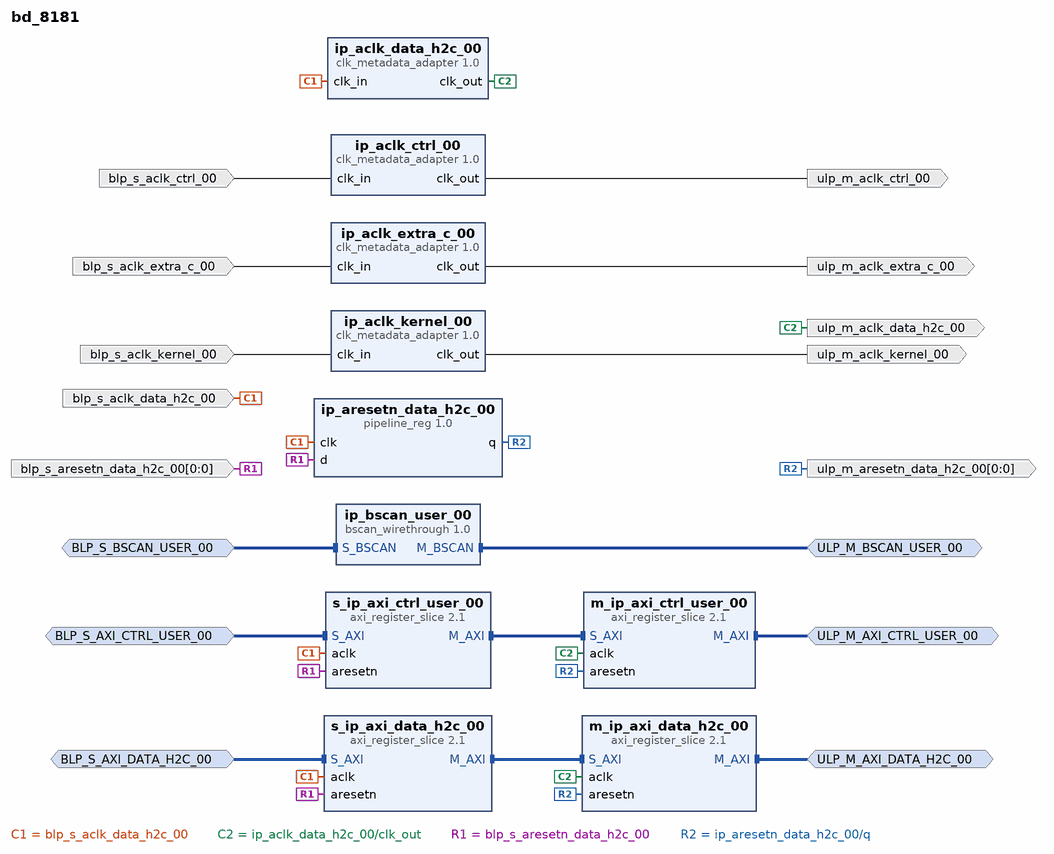
[diagram p0: block diagram of the top level]
# Vivado block design bd_8181, xcvu9p-flgb2104-2-i, Vivado 2019.2
create_bd_design bd_8181

create_bd_intf_port -mode Slave -vlnv xilinx.com:interface:aximm_rtl:1.0 BLP_S_AXI_CTRL_USER_00
set_property -dict [list \
  CONFIG.DATA_WIDTH 32 \
  CONFIG.FREQ_HZ 250000000 \
  CONFIG.ADDR_WIDTH 25 \
  CONFIG.AWUSER_WIDTH 0 \
  CONFIG.ARUSER_WIDTH 0 \
  CONFIG.WUSER_WIDTH 0 \
  CONFIG.RUSER_WIDTH 0 \
  CONFIG.BUSER_WIDTH 0 \
  CONFIG.READ_WRITE_MODE READ_WRITE \
  CONFIG.NUM_READ_OUTSTANDING 2 \
  CONFIG.NUM_WRITE_OUTSTANDING 2 \
  CONFIG.PHASE 0 \
  CONFIG.CLK_DOMAIN cd_data_h2c_00 \
  CONFIG.SLR_ASSIGNMENT slr0 \
] [get_bd_intf_ports BLP_S_AXI_CTRL_USER_00]
create_bd_intf_port -mode Master -vlnv xilinx.com:interface:aximm_rtl:1.0 ULP_M_AXI_CTRL_USER_00
set_property -dict [list \
  CONFIG.DATA_WIDTH 32 \
  CONFIG.FREQ_HZ 250000000 \
  CONFIG.ADDR_WIDTH 25 \
  CONFIG.AWUSER_WIDTH 0 \
  CONFIG.ARUSER_WIDTH 0 \
  CONFIG.WUSER_WIDTH 0 \
  CONFIG.RUSER_WIDTH 0 \
  CONFIG.BUSER_WIDTH 0 \
  CONFIG.READ_WRITE_MODE READ_WRITE \
  CONFIG.NUM_READ_OUTSTANDING 2 \
  CONFIG.NUM_WRITE_OUTSTANDING 2 \
  CONFIG.PHASE 0 \
  CONFIG.CLK_DOMAIN cd_data_h2c_00 \
  CONFIG.SLR_ASSIGNMENT slr0 \
] [get_bd_intf_ports ULP_M_AXI_CTRL_USER_00]
create_bd_intf_port -mode Slave -vlnv xilinx.com:interface:aximm_rtl:1.0 BLP_S_AXI_DATA_H2C_00
set_property -dict [list \
  CONFIG.PROTOCOL AXI4 \
  CONFIG.FREQ_HZ 250000000 \
  CONFIG.ADDR_WIDTH 64 \
  CONFIG.AWUSER_WIDTH 0 \
  CONFIG.ARUSER_WIDTH 0 \
  CONFIG.WUSER_WIDTH 0 \
  CONFIG.RUSER_WIDTH 0 \
  CONFIG.BUSER_WIDTH 0 \
  CONFIG.READ_WRITE_MODE READ_WRITE \
  CONFIG.HAS_BURST 1 \
  CONFIG.HAS_WSTRB 1 \
  CONFIG.HAS_BRESP 1 \
  CONFIG.HAS_RRESP 1 \
  CONFIG.SUPPORTS_NARROW_BURST 0 \
  CONFIG.NUM_READ_OUTSTANDING 16 \
  CONFIG.NUM_WRITE_OUTSTANDING 16 \
  CONFIG.MAX_BURST_LENGTH 256 \
  CONFIG.PHASE 0 \
  CONFIG.CLK_DOMAIN cd_data_h2c_00 \
  CONFIG.NUM_READ_THREADS 2 \
  CONFIG.NUM_WRITE_THREADS 2 \
  CONFIG.RUSER_BITS_PER_BYTE 0 \
  CONFIG.WUSER_BITS_PER_BYTE 0 \
  CONFIG.SLR_ASSIGNMENT slr0 \
] [get_bd_intf_ports BLP_S_AXI_DATA_H2C_00]
create_bd_intf_port -mode Master -vlnv xilinx.com:interface:aximm_rtl:1.0 ULP_M_AXI_DATA_H2C_00
set_property -dict [list \
  CONFIG.PROTOCOL AXI4 \
  CONFIG.FREQ_HZ 250000000 \
  CONFIG.ADDR_WIDTH 64 \
  CONFIG.AWUSER_WIDTH 0 \
  CONFIG.ARUSER_WIDTH 0 \
  CONFIG.WUSER_WIDTH 0 \
  CONFIG.RUSER_WIDTH 0 \
  CONFIG.BUSER_WIDTH 0 \
  CONFIG.READ_WRITE_MODE READ_WRITE \
  CONFIG.HAS_BURST 1 \
  CONFIG.HAS_WSTRB 1 \
  CONFIG.HAS_BRESP 1 \
  CONFIG.HAS_RRESP 1 \
  CONFIG.SUPPORTS_NARROW_BURST 0 \
  CONFIG.NUM_READ_OUTSTANDING 16 \
  CONFIG.NUM_WRITE_OUTSTANDING 16 \
  CONFIG.MAX_BURST_LENGTH 256 \
  CONFIG.PHASE 0 \
  CONFIG.CLK_DOMAIN cd_data_h2c_00 \
  CONFIG.NUM_READ_THREADS 2 \
  CONFIG.NUM_WRITE_THREADS 2 \
  CONFIG.RUSER_BITS_PER_BYTE 0 \
  CONFIG.WUSER_BITS_PER_BYTE 0 \
  CONFIG.SLR_ASSIGNMENT slr0 \
] [get_bd_intf_ports ULP_M_AXI_DATA_H2C_00]
create_bd_intf_port -mode Slave -vlnv xilinx.com:interface:bscan_rtl:1.0 BLP_S_BSCAN_USER_00
create_bd_intf_port -mode Master -vlnv xilinx.com:interface:bscan_rtl:1.0 ULP_M_BSCAN_USER_00
create_bd_port -dir I -type clk blp_s_aclk_ctrl_00
set_property -dict {CONFIG.CLK_DOMAIN cd_ctrl_00 CONFIG.FREQ_HZ 125000000 CONFIG.PHASE 0} [get_bd_ports blp_s_aclk_ctrl_00]
create_bd_port -dir O -type clk ulp_m_aclk_ctrl_00
set_property -dict {CONFIG.CLK_DOMAIN cd_ctrl_00 CONFIG.FREQ_HZ 125000000 CONFIG.PHASE 0} [get_bd_ports ulp_m_aclk_ctrl_00]
create_bd_port -dir I -type clk blp_s_aclk_extra_c_00
set_property -dict {CONFIG.CLK_DOMAIN cd_extra_c_00 CONFIG.FREQ_HZ 500000000 CONFIG.PHASE 0} [get_bd_ports blp_s_aclk_extra_c_00]
create_bd_port -dir O -type clk ulp_m_aclk_extra_c_00
set_property -dict {CONFIG.CLK_DOMAIN cd_extra_c_00 CONFIG.FREQ_HZ 500000000 CONFIG.PHASE 0} [get_bd_ports ulp_m_aclk_extra_c_00]
create_bd_port -dir I -type clk blp_s_aclk_data_h2c_00
set_property -dict [list \
  CONFIG.ASSOCIATED_RESET BLP_S_ARESETN_DATA_H2C_00 \
  CONFIG.CLK_DOMAIN cd_data_h2c_00 \
  CONFIG.FREQ_HZ 250000000 \
  CONFIG.PHASE 0 \
] [get_bd_ports blp_s_aclk_data_h2c_00]
create_bd_port -dir O -type clk ulp_m_aclk_data_h2c_00
set_property -dict [list \
  CONFIG.ASSOCIATED_RESET ULP_M_ARESETN_DATA_H2C_00 \
  CONFIG.CLK_DOMAIN cd_data_h2c_00 \
  CONFIG.FREQ_HZ 250000000 \
  CONFIG.PHASE 0 \
] [get_bd_ports ulp_m_aclk_data_h2c_00]
create_bd_port -dir I -type clk blp_s_aclk_kernel_00
set_property -dict {CONFIG.CLK_DOMAIN cd_extra_b_00 CONFIG.FREQ_HZ 250000000 CONFIG.PHASE 0} [get_bd_ports blp_s_aclk_kernel_00]
create_bd_port -dir O -type clk ulp_m_aclk_kernel_00
set_property -dict {CONFIG.CLK_DOMAIN cd_extra_b_00 CONFIG.FREQ_HZ 250000000 CONFIG.PHASE 0} [get_bd_ports ulp_m_aclk_kernel_00]
create_bd_port -dir I -from 0 -to 0 -type rst blp_s_aresetn_data_h2c_00
set_property -dict {CONFIG.POLARITY ACTIVE_LOW} [get_bd_ports blp_s_aresetn_data_h2c_00]
create_bd_port -dir O -from 0 -to 0 -type rst ulp_m_aresetn_data_h2c_00
set_property -dict {CONFIG.POLARITY ACTIVE_LOW} [get_bd_ports ulp_m_aresetn_data_h2c_00]

create_bd_cell -type ip -vlnv xilinx.com:ip:clk_metadata_adapter:1.0 ip_aclk_ctrl_00
create_bd_cell -type ip -vlnv xilinx.com:ip:clk_metadata_adapter:1.0 ip_aclk_extra_c_00
create_bd_cell -type ip -vlnv xilinx.com:ip:clk_metadata_adapter:1.0 ip_aclk_data_h2c_00
create_bd_cell -type ip -vlnv xilinx.com:ip:clk_metadata_adapter:1.0 ip_aclk_kernel_00
create_bd_cell -type ip -vlnv xilinx.com:ip:pipeline_reg:1.0 ip_aresetn_data_h2c_00
set_property -dict {CONFIG.DEPTH 0} [get_bd_cells ip_aresetn_data_h2c_00]
create_bd_cell -type ip -vlnv xilinx.com:ip:axi_register_slice:2.1 s_ip_axi_ctrl_user_00
set_property -dict [list \
  CONFIG.ADDR_WIDTH 25 \
  CONFIG.DATA_WIDTH 32 \
  CONFIG.NUM_READ_OUTSTANDING 2 \
  CONFIG.NUM_WRITE_OUTSTANDING 2 \
  CONFIG.PROTOCOL AXI4LITE \
  CONFIG.READ_WRITE_MODE READ_WRITE \
  CONFIG.REG_AR 0 \
  CONFIG.REG_AW 0 \
  CONFIG.REG_B 0 \
  CONFIG.REG_R 0 \
  CONFIG.REG_W 0 \
] [get_bd_cells s_ip_axi_ctrl_user_00]
create_bd_cell -type ip -vlnv xilinx.com:ip:axi_register_slice:2.1 m_ip_axi_ctrl_user_00
set_property -dict [list \
  CONFIG.ADDR_WIDTH 25 \
  CONFIG.DATA_WIDTH 32 \
  CONFIG.NUM_READ_OUTSTANDING 2 \
  CONFIG.NUM_WRITE_OUTSTANDING 2 \
  CONFIG.PROTOCOL AXI4LITE \
  CONFIG.READ_WRITE_MODE READ_WRITE \
  CONFIG.REG_AR 0 \
  CONFIG.REG_AW 0 \
  CONFIG.REG_B 0 \
  CONFIG.REG_R 0 \
  CONFIG.REG_W 0 \
] [get_bd_cells m_ip_axi_ctrl_user_00]
create_bd_cell -type ip -vlnv xilinx.com:ip:axi_register_slice:2.1 s_ip_axi_data_h2c_00
set_property -dict [list \
  CONFIG.ADDR_WIDTH 64 \
  CONFIG.ARUSER_WIDTH 0 \
  CONFIG.AWUSER_WIDTH 0 \
  CONFIG.BUSER_WIDTH 0 \
  CONFIG.DATA_WIDTH 512 \
  CONFIG.HAS_BRESP 1 \
  CONFIG.HAS_BURST 1 \
  CONFIG.HAS_CACHE 0 \
  CONFIG.HAS_LOCK 0 \
  CONFIG.HAS_PROT 0 \
  CONFIG.HAS_QOS 0 \
  CONFIG.HAS_REGION 0 \
  CONFIG.HAS_RRESP 1 \
  CONFIG.HAS_WSTRB 1 \
  CONFIG.ID_WIDTH 6 \
  CONFIG.MAX_BURST_LENGTH 256 \
  CONFIG.NUM_READ_OUTSTANDING 16 \
  CONFIG.NUM_READ_THREADS 2 \
  CONFIG.NUM_WRITE_OUTSTANDING 16 \
  CONFIG.NUM_WRITE_THREADS 2 \
  CONFIG.PROTOCOL AXI4 \
  CONFIG.READ_WRITE_MODE READ_WRITE \
  CONFIG.REG_AR 0 \
  CONFIG.REG_AW 0 \
  CONFIG.REG_B 0 \
  CONFIG.REG_R 0 \
  CONFIG.REG_W 0 \
  CONFIG.RUSER_BITS_PER_BYTE 0 \
  CONFIG.RUSER_WIDTH 0 \
  CONFIG.SUPPORTS_NARROW_BURST 0 \
  CONFIG.WUSER_BITS_PER_BYTE 0 \
  CONFIG.WUSER_WIDTH 0 \
] [get_bd_cells s_ip_axi_data_h2c_00]
create_bd_cell -type ip -vlnv xilinx.com:ip:axi_register_slice:2.1 m_ip_axi_data_h2c_00
set_property -dict [list \
  CONFIG.ADDR_WIDTH 64 \
  CONFIG.ARUSER_WIDTH 0 \
  CONFIG.AWUSER_WIDTH 0 \
  CONFIG.BUSER_WIDTH 0 \
  CONFIG.DATA_WIDTH 512 \
  CONFIG.HAS_BRESP 1 \
  CONFIG.HAS_BURST 1 \
  CONFIG.HAS_CACHE 0 \
  CONFIG.HAS_LOCK 0 \
  CONFIG.HAS_PROT 0 \
  CONFIG.HAS_QOS 0 \
  CONFIG.HAS_REGION 0 \
  CONFIG.HAS_RRESP 1 \
  CONFIG.HAS_WSTRB 1 \
  CONFIG.ID_WIDTH 6 \
  CONFIG.MAX_BURST_LENGTH 256 \
  CONFIG.NUM_READ_OUTSTANDING 16 \
  CONFIG.NUM_READ_THREADS 2 \
  CONFIG.NUM_WRITE_OUTSTANDING 16 \
  CONFIG.NUM_WRITE_THREADS 2 \
  CONFIG.PROTOCOL AXI4 \
  CONFIG.READ_WRITE_MODE READ_WRITE \
  CONFIG.REG_AR 0 \
  CONFIG.REG_AW 0 \
  CONFIG.REG_B 0 \
  CONFIG.REG_R 0 \
  CONFIG.REG_W 0 \
  CONFIG.RUSER_BITS_PER_BYTE 0 \
  CONFIG.RUSER_WIDTH 0 \
  CONFIG.SUPPORTS_NARROW_BURST 0 \
  CONFIG.WUSER_BITS_PER_BYTE 0 \
  CONFIG.WUSER_WIDTH 0 \
] [get_bd_cells m_ip_axi_data_h2c_00]
create_bd_cell -type ip -vlnv xilinx.com:ip:bscan_wirethrough:1.0 ip_bscan_user_00
set_property -dict {CONFIG.C_HAS_BSCANID 0} [get_bd_cells ip_bscan_user_00]

# ---- connections ----

connect_bd_intf_net [get_bd_intf_ports ULP_M_BSCAN_USER_00] [get_bd_intf_pins ip_bscan_user_00/M_BSCAN]
connect_bd_intf_net -intf_net BLP_S_BSCAN_USER_00_1 [get_bd_intf_ports BLP_S_BSCAN_USER_00] [get_bd_intf_pins ip_bscan_user_00/S_BSCAN]
connect_bd_intf_net [get_bd_intf_ports ULP_M_AXI_DATA_H2C_00] [get_bd_intf_pins m_ip_axi_data_h2c_00/M_AXI]
connect_bd_intf_net [get_bd_intf_pins s_ip_axi_data_h2c_00/M_AXI] [get_bd_intf_pins m_ip_axi_data_h2c_00/S_AXI]
connect_bd_intf_net -intf_net BLP_S_AXI_DATA_H2C_00_1 [get_bd_intf_ports BLP_S_AXI_DATA_H2C_00] [get_bd_intf_pins s_ip_axi_data_h2c_00/S_AXI]
connect_bd_intf_net [get_bd_intf_ports ULP_M_AXI_CTRL_USER_00] [get_bd_intf_pins m_ip_axi_ctrl_user_00/M_AXI]
connect_bd_intf_net -intf_net BLP_S_AXI_CTRL_USER_00_1 [get_bd_intf_ports BLP_S_AXI_CTRL_USER_00] [get_bd_intf_pins s_ip_axi_ctrl_user_00/S_AXI]
connect_bd_intf_net [get_bd_intf_pins s_ip_axi_ctrl_user_00/M_AXI] [get_bd_intf_pins m_ip_axi_ctrl_user_00/S_AXI]
connect_bd_net -net blp_s_aclk_ctrl_00_1 [get_bd_ports blp_s_aclk_ctrl_00] [get_bd_pins ip_aclk_ctrl_00/clk_in]
connect_bd_net [get_bd_pins ip_aclk_ctrl_00/clk_out] [get_bd_ports ulp_m_aclk_ctrl_00]
connect_bd_net -net blp_s_aclk_extra_c_00_1 [get_bd_ports blp_s_aclk_extra_c_00] [get_bd_pins ip_aclk_extra_c_00/clk_in]
connect_bd_net [get_bd_pins ip_aclk_extra_c_00/clk_out] [get_bd_ports ulp_m_aclk_extra_c_00]
connect_bd_net -net blp_s_aclk_data_h2c_00_1 [get_bd_ports blp_s_aclk_data_h2c_00] \
  [get_bd_pins ip_aclk_data_h2c_00/clk_in] [get_bd_pins ip_aresetn_data_h2c_00/clk] [get_bd_pins s_ip_axi_ctrl_user_00/aclk] \
  [get_bd_pins s_ip_axi_data_h2c_00/aclk]
connect_bd_net [get_bd_pins ip_aclk_data_h2c_00/clk_out] \
  [get_bd_ports ulp_m_aclk_data_h2c_00] [get_bd_pins m_ip_axi_ctrl_user_00/aclk] [get_bd_pins m_ip_axi_data_h2c_00/aclk]
connect_bd_net -net blp_s_aclk_kernel_00_1 [get_bd_ports blp_s_aclk_kernel_00] [get_bd_pins ip_aclk_kernel_00/clk_in]
connect_bd_net [get_bd_pins ip_aclk_kernel_00/clk_out] [get_bd_ports ulp_m_aclk_kernel_00]
connect_bd_net -net blp_s_aresetn_data_h2c_00_1 [get_bd_ports blp_s_aresetn_data_h2c_00] \
  [get_bd_pins ip_aresetn_data_h2c_00/d] [get_bd_pins s_ip_axi_ctrl_user_00/aresetn] \
  [get_bd_pins s_ip_axi_data_h2c_00/aresetn]
connect_bd_net [get_bd_pins ip_aresetn_data_h2c_00/q] \
  [get_bd_ports ulp_m_aresetn_data_h2c_00] [get_bd_pins m_ip_axi_ctrl_user_00/aresetn] \
  [get_bd_pins m_ip_axi_data_h2c_00/aresetn]

validate_bd_design
save_bd_design
